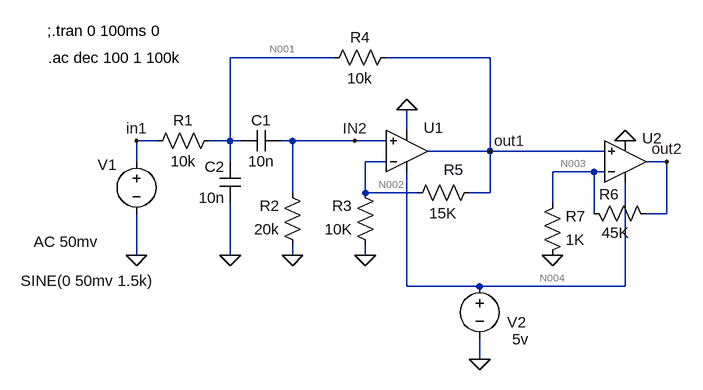
[diagram p0: schematic SallenKey.asc]
SallenKey.asc, the LTspice schematic file:
Version 4
SHEET 1 924 680
WIRE 368 -16 208 -16
WIRE 608 -16 448 -16
WIRE 480 96 480 64
WIRE 96 112 64 112
WIRE 208 112 208 -16
WIRE 208 112 176 112
WIRE 224 112 208 112
WIRE 304 112 288 112
WIRE 400 112 304 112
WIRE 448 112 400 112
WIRE 608 128 608 -16
WIRE 608 128 512 128
WIRE 784 128 608 128
WIRE 64 144 64 112
WIRE 208 144 208 112
WIRE 448 144 416 144
WIRE 880 144 848 144
WIRE 768 160 704 160
WIRE 784 160 768 160
WIRE 304 192 304 112
WIRE 416 192 416 144
WIRE 496 192 416 192
WIRE 608 192 608 128
WIRE 608 192 576 192
WIRE 704 208 704 160
WIRE 768 224 768 160
WIRE 880 224 880 144
WIRE 880 224 848 224
WIRE 64 288 64 224
WIRE 208 288 208 208
WIRE 304 288 304 272
WIRE 416 288 416 272
WIRE 480 336 480 160
WIRE 592 336 480 336
WIRE 816 336 816 176
WIRE 816 336 592 336
WIRE 592 448 592 416
FLAG 208 288 0
FLAG 304 288 0
FLAG 416 288 0
FLAG 64 288 0
FLAG 480 64 0
FLAG 592 448 0
FLAG 608 128 out1
FLAG 64 112 in1
FLAG 704 288 0
FLAG 816 112 0
FLAG 400 112 IN2
FLAG 880 144 out2
SYMBOL res 192 96 R90
WINDOW 0 0 56 VBottom 2
WINDOW 3 32 56 VTop 2
SYMATTR InstName R1
SYMATTR Value 10k
SYMBOL res 320 288 R180
WINDOW 0 36 76 Left 2
WINDOW 3 36 40 Left 2
SYMATTR InstName R2
SYMATTR Value 20k
SYMBOL res 432 288 R180
WINDOW 0 36 76 Left 2
WINDOW 3 36 40 Left 2
SYMATTR InstName R3
SYMATTR Value 10K
SYMBOL res 464 -32 R90
WINDOW 0 0 56 VBottom 2
WINDOW 3 32 56 VTop 2
SYMATTR InstName R4
SYMATTR Value 10k
SYMBOL cap 288 96 R90
WINDOW 0 0 32 VBottom 2
WINDOW 3 32 32 VTop 2
SYMATTR InstName C1
SYMATTR Value 10n
SYMBOL cap 224 208 R180
WINDOW 0 24 56 Left 2
WINDOW 3 24 8 Left 2
SYMATTR InstName C2
SYMATTR Value 10n
SYMBOL res 592 176 R90
WINDOW 0 -4 40 VBottom 2
WINDOW 3 32 56 VTop 2
SYMATTR InstName R5
SYMATTR Value 15K
SYMBOL OpAmps\\UniversalOpAmp2 480 128 M180
WINDOW 0 26 36 Left 2
SYMATTR InstName U1
SYMBOL voltage 64 128 R0
WINDOW 0 -60 21 Left 2
WINDOW 3 -178 199 Left 2
WINDOW 123 -158 139 Left 2
WINDOW 39 0 0 Left 0
SYMATTR InstName V1
SYMATTR Value SINE(0 50mv 1.5k)
SYMATTR Value2 AC 50mv
SYMBOL voltage 592 320 R0
WINDOW 0 42 71 Left 2
WINDOW 3 50 97 Left 2
SYMATTR InstName V2
SYMATTR Value 5v
SYMBOL OpAmps\\UniversalOpAmp2 816 144 M180
WINDOW 0 26 36 Left 2
SYMATTR InstName U2
SYMBOL res 752 208 M90
WINDOW 0 2 39 VBottom 2
WINDOW 3 30 49 VTop 2
SYMATTR InstName R6
SYMATTR Value 45K
SYMBOL res 688 304 M180
WINDOW 0 36 76 Left 2
WINDOW 3 36 40 Left 2
SYMATTR InstName R7
SYMATTR Value 1K
TEXT -72 -16 Left 2 !.ac dec 100 1 100k
TEXT -73 -57 Left 2 !;.tran 0 100ms 0

The netlist it stands for:
* SallenKey.asc
R1 N001 in1 10k
R2 0 IN2 20k
R3 0 N002 10K
R4 out1 N001 10k
C1 IN2 N001 10n
C2 0 N001 10n
R5 out1 N002 15K
XU1 IN2 N002 N004 0 out1 level2 Avol=1Meg GBW=10Meg Slew=10Meg Ilimit=25m Rail=0 Vos=0 En=0 Enk=0 In=0 Ink=0 Rin=500Meg  ; pins In+ In- V+ V- OUT
V1 in1 0 SINE(0 50mv 1.5k) AC 50mv
V2 N004 0 5v
XU2 out1 N003 N004 0 out2 level2 Avol=1Meg GBW=10Meg Slew=10Meg Ilimit=25m Rail=0 Vos=0 En=0 Enk=0 In=0 Ink=0 Rin=500Meg  ; pins In+ In- V+ V- OUT
R6 N003 out2 45K
R7 0 N003 1K
.ac dec 100 1 100k
;.tran 0 100ms 0
.lib UniversalOpAmp2.lib
.backanno
.end

* Results of the author's LTspice run, read from the files saved beside the schematic
* Operating Point, zero values left out:
*   V(n001) = 142.3 µV
*   V(in2) = 100 µV
*   V(n002) = 143.8 µV
*   V(out1) = 284.6 µV
*   V(n004) = 5 V
*   V(out2) = 13.19 mV
*   V(n003) = 291.7 µV
*   I(R1) = 14.23 nA
*   I(R2) = -5 nA
*   I(R3) = -14.38 nA
*   I(R4) = 14.23 nA
*   I(R5) = 9.384 nA
*   I(R6) = -286.7 nA
*   I(R7) = -291.7 nA
*   I(V1) = 14.23 nA
*   I(V2) = -29.64 µA
*   Ix(u1:1) = -5 nA
*   Ix(u1:2) = -5 nA
*   Ix(u1:3) = 3.817 µA
*   Ix(u1:4) = -3.762 µA
*   Ix(u1:5) = -18.61 nA
*   Ix(u2:1) = -4.999 nA
*   Ix(u2:2) = -4.999 nA
*   Ix(u2:3) = 25.83 µA
*   Ix(u2:4) = -25.5 µA
*   Ix(u2:5) = -286.7 nA
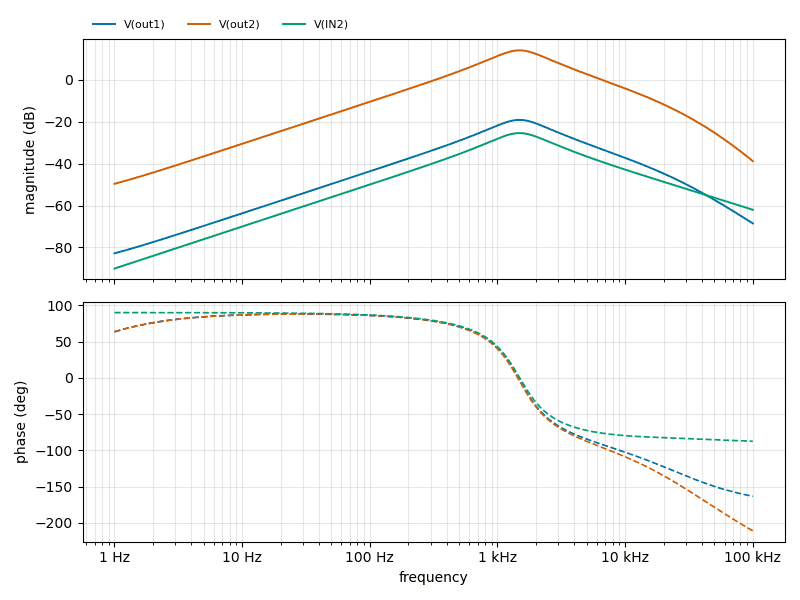
[diagram p1: AC Analysis of SallenKey.asc, plotted from the saved traces]
* AC Analysis, 1 run:
*   V(out1): -82.78 dB at 1 Hz, -68.53 dB at 100 kHz, peak -19.20 dB at 1.479 kHz, 3 dB below the peak at 969.2 Hz and 2.273 kHz
*   V(out2): -49.66 dB at 1 Hz, -38.84 dB at 100 kHz, peak 13.93 dB at 1.479 kHz, 3 dB below the peak at 969.2 Hz and 2.272 kHz
*   V(IN2): -90.05 dB at 1 Hz, -62.05 dB at 100 kHz, peak -25.49 dB at 1.479 kHz, 3 dB below the peak at 970.1 Hz and 2.278 kHz